# Altium schematic sheet Sheet1.SchDoc
size 420 x 297 mm; SheetNumber: 1; SheetTotal: 1
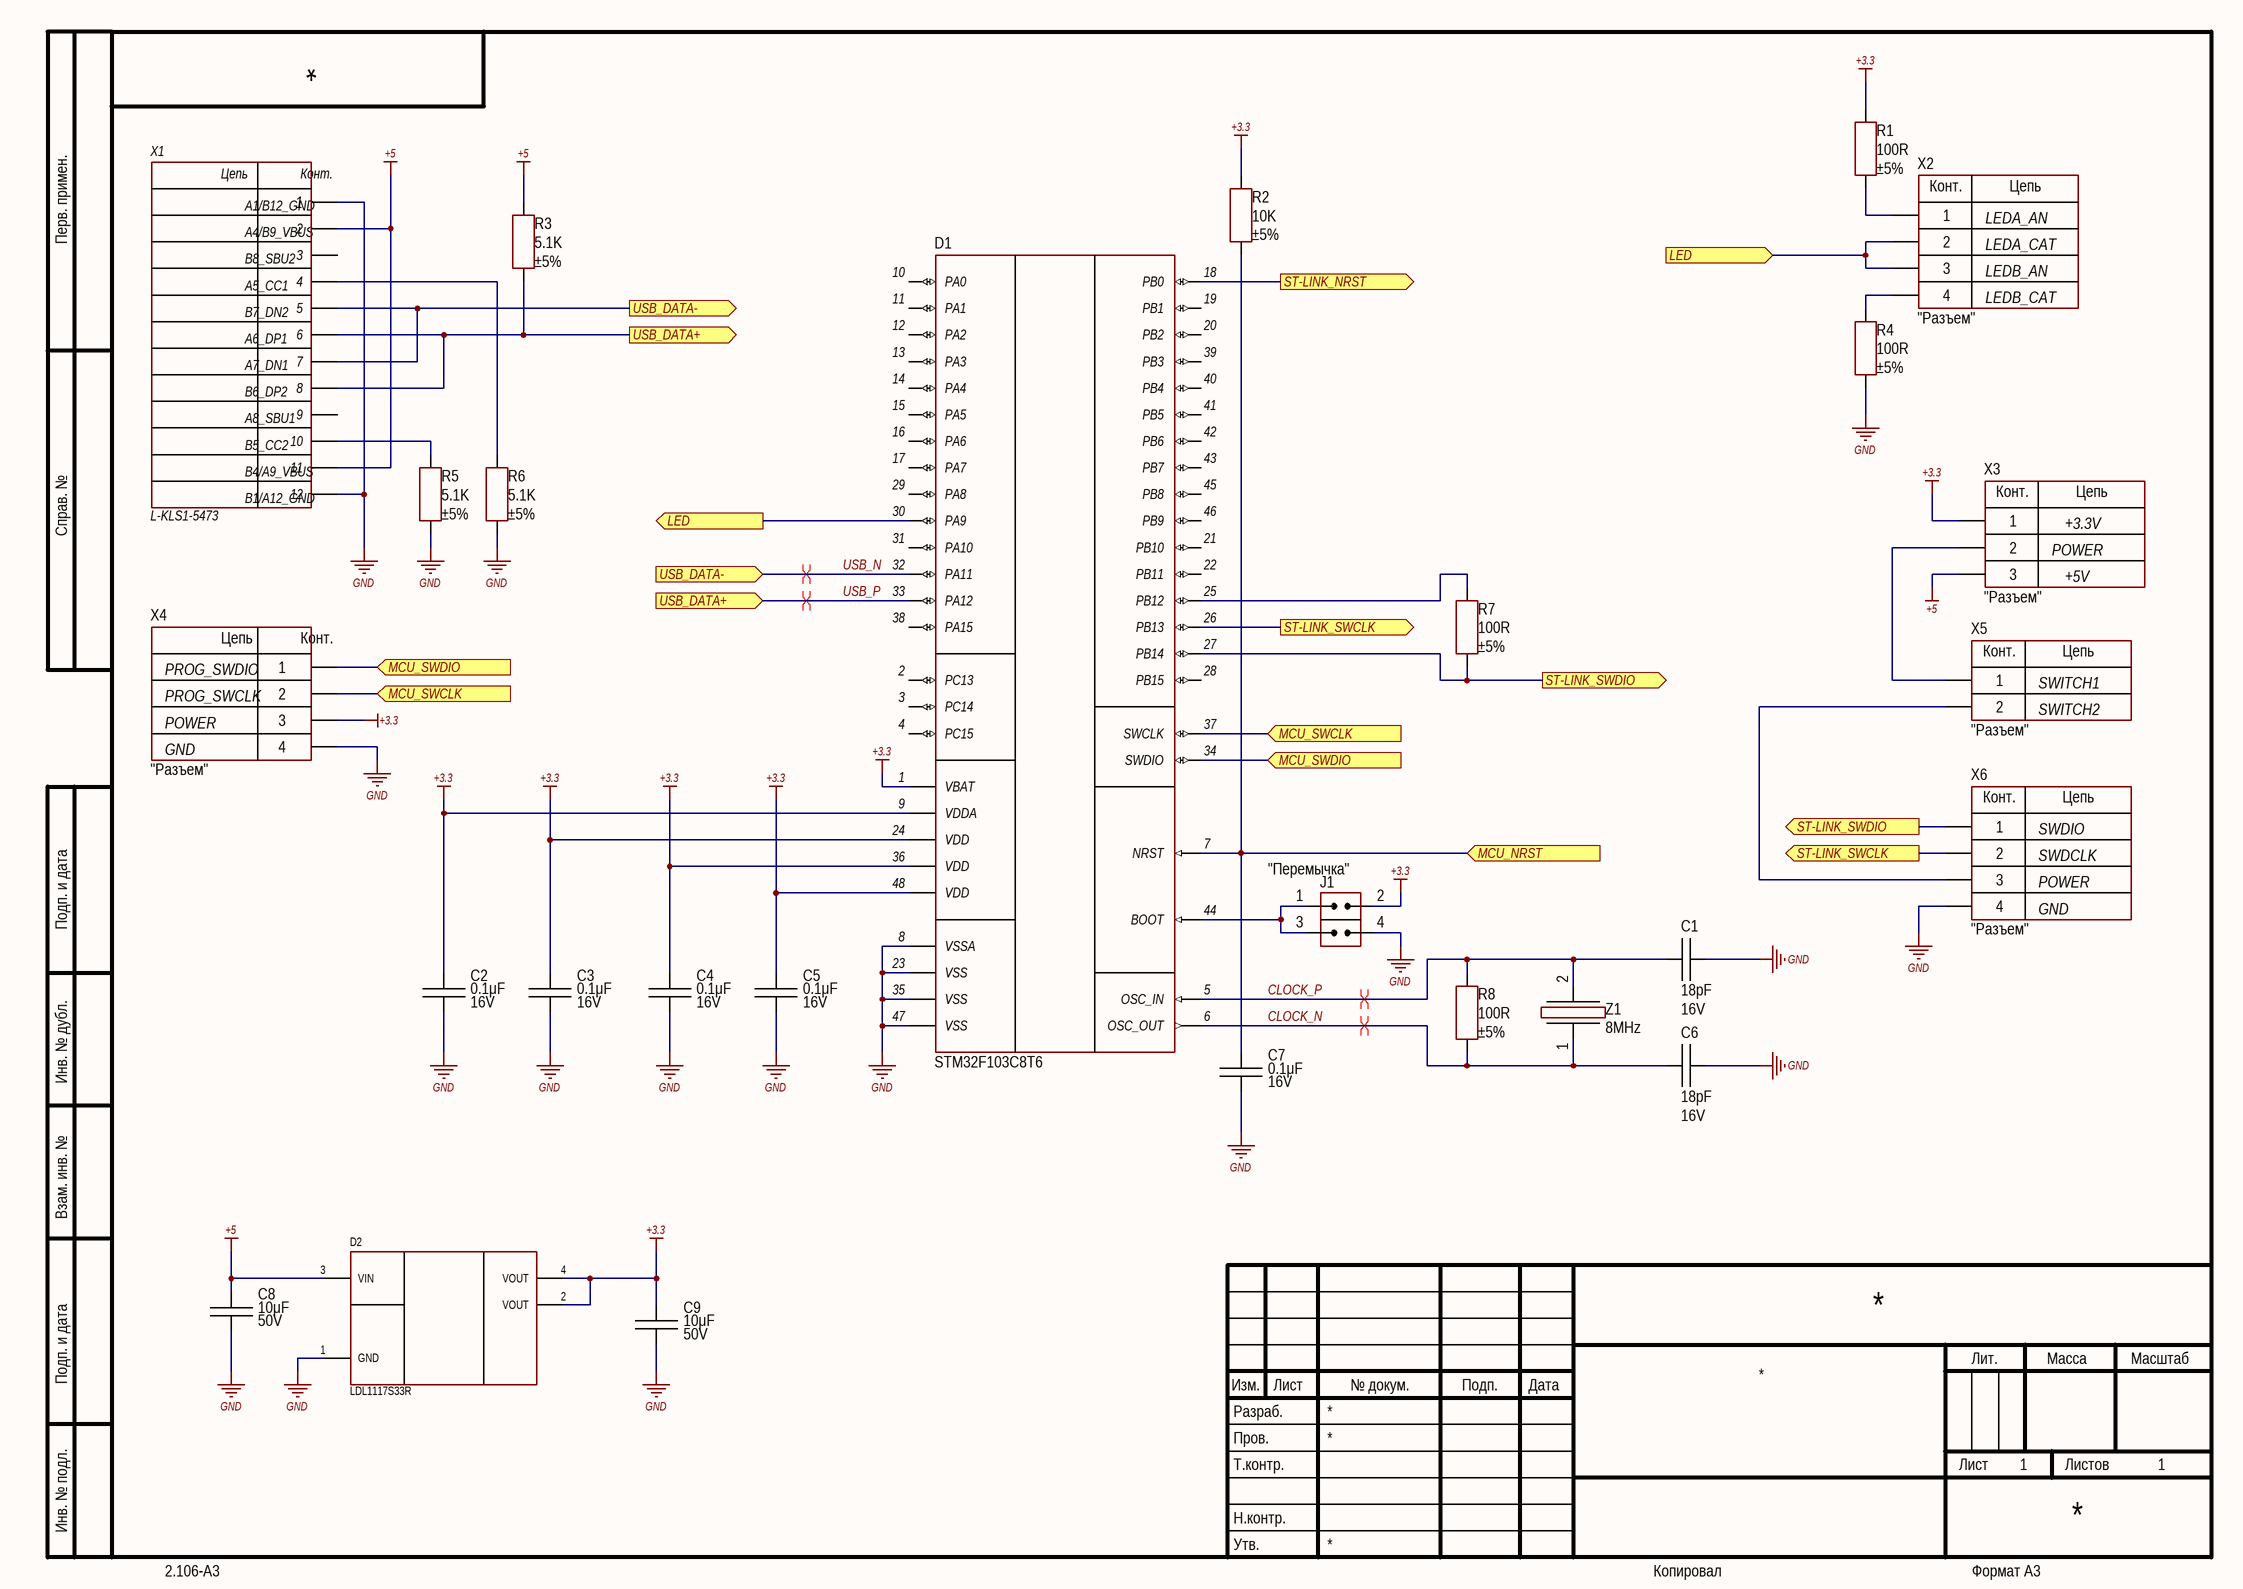
[diagram p0: Sheet1.SchDoc]

## Parts
C1  value 18pF  Voltage: 16V  [CAP: 0603]
C2  value 0.1μF  Voltage: 16V  [CAP: 0603]
C3  value 0.1μF  Voltage: 16V  [CAP: 0603]
C4  value 0.1μF  Voltage: 16V  [CAP: 0603]
C5  value 0.1μF  Voltage: 16V  [CAP: 0603]
C6  value 18pF  Voltage: 16V  [CAP: 0603]
C7  value 0.1μF  Voltage: 16V  [CAP: 0603]
C8  value 10μF  Voltage: 50V  [CAP: 1206]
C9  value 10μF  Voltage: 50V  [CAP: 1206]
D1  (no value)  [48-LQFP]
D2  (no value)  [SOT223]
J1  CommentText: "Перемычка"  [CON: JUMPER x2]
R1  value 100R  Tolerance: ±5%  [RES: 0603]
R2  value 10K  Tolerance: ±5%  [RES: 0603]
R3  value 5.1K  Tolerance: ±5%  [RES: 0603]
R4  value 100R  Tolerance: ±5%  [RES: 0603]
R5  value 5.1K  Tolerance: ±5%  [RES: 0603]
R6  value 5.1K  Tolerance: ±5%  [RES: 0603]
R7  value 100R  Tolerance: ±5%  [RES: 0603]
R8  value 100R  Tolerance: ±5%  [RES: 0603]
X1  (no value)  [USB type-C]
X2  CommentText: "Разъем"  [CON: PBS-4]
X3  CommentText: "Разъем"  [CON: PLS-3]
X4  CommentText: "Разъем"  [CON: PLS-4]
X5  CommentText: "Разъем"  [CON: PLS-2]
X6  CommentText: "Разъем"  [CON: PBS-4]
Z1  Frequency: 8MHz  [OSC: HC-49S]

## Ports
LED (in, see Sheet1[2B]), LED (out, see Sheet1[3A]), MCU_NRST (in), MCU_SWCLK (in, see Sheet1[1B]), MCU_SWCLK (in, see Sheet1[3B]), MCU_SWDIO (in, see Sheet1[1B]), MCU_SWDIO (in, see Sheet1[3B]), ST-LINK_NRST (out), ST-LINK_SWCLK (out, see Sheet1[3B]), ST-LINK_SWCLK (out, see Sheet1[4C]), ST-LINK_SWDIO (out, see Sheet1[3B]), ST-LINK_SWDIO (out, see Sheet1[4C]), USB_DATA+ (in, see Sheet1[2A]), USB_DATA+ (out, see Sheet1[2B]), USB_DATA- (in, see Sheet1[2A]), USB_DATA- (out, see Sheet1[2B])

## Nets
+3.3: C2.2 C3.2 C4.2 C5.2 C9.2 D1.1(VBAT) D1.9(VDDA) D1.24(VDD) D1.36(VDD) D1.48(VDD) D2.2(VOUT) D2.4(VOUT) J1.2(IN) R1.2 R2.2 X3.1 X4.3
+5: C8.2 D2.3(VIN) R3.2 X1.2 X1.11 X3.3
GND: C1.1 C2.1 C3.1 C4.1 C5.1 C6.1 C7.1 C8.1 C9.1 D1.8(VSSA) D1.23(VSS) D1.35(VSS) D1.47(VSS) D2.1(GND) J1.4(IN) R4.1 R5.1 R6.1 X1.1 X1.12 X4.4 X6.4
CLOCK_N: C6.2 D1.6(OSC_OUT) R8.1 Z1.1
CLOCK_P: C1.2 D1.5(OSC_IN) R8.2 Z1.2
LED: D1.30(PA9) X2.2 X2.3 ; port LED
MCU_NRST: C7.2 D1.7(NRST) R2.1 ; port MCU_NRST
MCU_SWCLK: D1.37(SWCLK) X4.2 ; port MCU_SWCLK
MCU_SWDIO: D1.34(SWDIO) X4.1 ; port MCU_SWDIO
ST-LINK_NRST: D1.18(PB0) ; port ST-LINK_NRST
ST-LINK_SWCLK: D1.26(PB13) X6.2 ; port ST-LINK_SWCLK
ST-LINK_SWDIO: D1.27(PB14) R7.1 X6.1 ; port ST-LINK_SWDIO
USB_N: D1.32(PA11) X1.5 X1.7 ; port USB_DATA-
USB_P: D1.33(PA12) R3.1 X1.6 X1.8 ; port USB_DATA+
NetD1_25: D1.25(PB12) R7.2
NetD1_44: D1.44(BOOT) J1.1(IN) J1.3(IN)
NetR1_1: R1.1 X2.1
NetR4_2: R4.2 X2.4
NetR5_2: R5.2 X1.10
NetR6_2: R6.2 X1.4
NetX3_2: X3.2 X5.1
NetX5_2: X5.2 X6.3

Not connected (* = marked no-connect by the designer): D1 2(PC13) 3(PC14) 4(PC15) 10(PA0) 11(PA1) 12(PA2) 13(PA3) 14(PA4) 15(PA5) 16(PA6) 17(PA7) 19(PB1) 20(PB2) 21(PB10) 22(PB11) 28(PB15) 29(PA8) 31(PA10) 38(PA15) 39(PB3) 40(PB4) 41(PB5) 42(PB6) 43(PB7) 45(PB8) 46(PB9); X1 3 9

## Layout directives
differential pair: CLOCK_N, CLOCK_P, USB_N, USB_P

## Notes on the sheet
- LEDA_AN
- LEDA_CAT
- LEDB_AN
- LEDB_CAT
- +3.3V
- POWER
- +5V
- PROG_SWDIO
- PROG_SWCLK
- SWITCH1
- SWITCH2
- GND
- SWDIO
- SWDCLK
- Перв. примен.
- Справ. №
- Подп. и дата
- Инв. № дубл.
- Взам. инв. №
- Разраб.
- Изм.
- Лист
- № докум.
- Подп.
- Дата
- Лит.
- Масса
- Масштаб
- Пров.
- Т.контр.
- Листов
- Инв. № подл.
- Утв.
- Н.контр.
- 2.106-A3
- Копировал
- Формат А3
- (in symbol L-KLS1-5473) Цепь; Конт.; A1/B12_GND; A4/B9_VBUS; B8_SBU2; A5_CC1; B7_DN2; A6_DP1; A7_DN1; B6_DP2; A8_SBU1; B5_CC2; B4/A9_VBUS; B1/A12_GND
- (in symbol PBS-4) Конт.; Цепь
- (in symbol PLS-2) Конт.; Цепь
- (in symbol PLS-3) Конт.; Цепь
- (in symbol PLS-4) Цепь; Конт.

## Library data of the parts
C1 C6 = Ceramic_0603: Manufacturer: Yageo; PartNumber: CC0603KRX7R7BB104; ValueManufacturerPartNumber: Ceramic capacitor, 18pF, X7R, ±10%, 16V, 0603, -55...+125°C; TypeCapacitor: Ceramic capacitor; Tolerance: ±10%; TypeDielectric: X7R; Package: 0603; HelpURL: https://www.digikey.com/product-detail/en/yageo/CC0603KRX7R7BB104/311-1088-1-ND/302998; Temperature: -55...+125°C
C2-C5 C7 = Ceramic_0603: Manufacturer: Yageo; PartNumber: CC0603KRX7R7BB104; ValueManufacturerPartNumber: Ceramic capacitor, 0.1μF, X7R, ±10%, 16V, 0603, -55...+125°C; TypeCapacitor: Ceramic capacitor; Tolerance: ±10%; TypeDielectric: X7R; Package: 0603; HelpURL: https://www.digikey.com/product-detail/en/yageo/CC0603KRX7R7BB104/311-1088-1-ND/302998; Temperature: -55...+125°C
C8 C9 = Ceramic_1206: Manufacturer: Yageo; PartNumber: CC1206KRX7R9BB104; ValueManufacturerPartNumber: Ceramic capacitor, 10μF, X7R, ±10%, 50V, 1206, -55...+125°C; TypeCapacitor: Ceramic capacitor; Tolerance: ±10%; TypeDielectric: X7R; Package: 1206; HelpURL: https://www.digikey.com/product-detail/en/yageo/CC1206KRX7R9BB104/311-1179-1-ND/303089; Temperature: -55...+125°C
D1 = STM32F103C8T6: Cortex-M3; Manufacturer: STMicroelectronics; ValueManufacturerPartNumber: IC microcontroller, 32-Bit, Cortex-M3, 72MHz, 64KB, 20KB, 2...3.6V, -40...+85°C, 48-LQFP; Supply: 2...3.6V; Speed: 72MHz; CoreSize: 32-Bit; MemoryROM: 64KB; MemoryRAM: 20KB; HelpURL: https://www.digikey.com/product-detail/en/stmicroelectronics/STM32F103C8T6TR/497-17666-1-ND/7804402; Package: 48-LQFP; ComponentType: IC microcontroller; Temperature: -40...+85°C; CoreProcessor: Cortex-M3; PartNumber: STM32F103C8T6
D2 = LDL1117S33R: Linear voltage regulator; Manufacturer: STMicroelectronics; ValueManufacturerPartNumber: Linear voltage regulator, input 3.9...18V, 0.6V, output 3.3V, 1.2A, -40...+85°C, SOT223; VoltageInput: input 3.9...18V; MaxDropout: 0.6V; CurrentOutput: 1.2A; VoltageOutput: output 3.3V; HelpURL: https://www.digikey.com/product-detail/en/stmicroelectronics/LDL1117S33R/497-17239-1-ND/7102079; Package: SOT223; ComponentType: Linear voltage regulator; Temperature: -40...+85°C; PartNumber: LDL1117S33R
J1 = Jumper_double
R1 R4 R7 R8 = Resistor_0603: Manufacturer: Yageo; PartNumber: RC0603JR-07100RL; ValueManufacturerPartNumber: Resistor film, 100R, ±5%, 0603, 0.1W, -55...+125°C; TypeResistor: Resistor film; Power: 0.1W; Package: 0603; HelpURL: https://www.digikey.com/product-detail/en/yageo/RC0603JR-07100RL/311-100GRCT-ND/729644; Temperature: -55...+125°C
R2 = Resistor_0603: Manufacturer: Yageo; PartNumber: RC0603JR-07100RL; ValueManufacturerPartNumber: Resistor film, 10K, ±5%, 0603, 0.1W, -55...+125°C; TypeResistor: Resistor film; Power: 0.1W; Package: 0603; HelpURL: https://www.digikey.com/product-detail/en/yageo/RC0603JR-07100RL/311-100GRCT-ND/729644; Temperature: -55...+125°C
R3 R5 R6 = Resistor_0603: Manufacturer: Yageo; PartNumber: RC0603JR-07100RL; ValueManufacturerPartNumber: Resistor film, 5.1K, ±5%, 0603, 0.1W, -55...+125°C; TypeResistor: Resistor film; Power: 0.1W; Package: 0603; HelpURL: https://www.digikey.com/product-detail/en/yageo/RC0603JR-07100RL/311-100GRCT-ND/729644; Temperature: -55...+125°C
X1 = L-KLS1-5473: Разъем L-KLS1-5473 / гнездо USB C 3.1 на плату (C8); Manufacturer: KLS; HelpURL: https://belchip.by/product/?selected_product=15991; ValueManufacturerPartNumber: =TypeConnector; PartNumber: L-KLS1-5473; CommentText: L-KLS1-5473
X2 X6 = PBS-4: Manufacturer: Connfly; ValueManufacturerPartNumber: Connector, 4pin, 2.54mm, 500VAC, 3A; TypeConnector: Connector; VoltageMax: 500VAC; Pitch: 2.54mm; CurrentMax: 3A; Multichannel: 4pin; HelpURL: https://www.chipdip.ru/product/pbs-4; PartNumber: PBS-4
X3 = PLS-3: Manufacturer: Connfly; ValueManufacturerPartNumber: Connector, 3pin, 2.54mm, 500VAC, 3A; TypeConnector: Connector; VoltageMax: 500VAC; Pitch: 2.54mm; CurrentMax: 3A; Multichannel: 3pin; HelpURL: https://www.chipdip.ru/product/pls-3; PartNumber: PLS-3
X4 = PLS-4: Manufacturer: Connfly; ValueManufacturerPartNumber: Connector, 4pin, 2.54mm, 500VAC, 3A; TypeConnector: Connector; VoltageMax: 500VAC; Pitch: 2.54mm; CurrentMax: 3A; Multichannel: 4pin; HelpURL: https://www.chipdip.ru/product/pls-4; PartNumber: PLS-4
X5 = PLS-2: Manufacturer: Connfly; ValueManufacturerPartNumber: Connector, 2pin, 2.54mm, 500VAC, 3A; TypeConnector: Connector; VoltageMax: 500VAC; Pitch: 2.54mm; CurrentMax: 3A; Multichannel: 2pin; HelpURL: https://www.chipdip.ru/product/pls-2; PartNumber: PLS-2
Z1 = Crystal_HC-49: Manufacturer: Epson; PartNumber: FC-135 32.7680KA-A5; ValueManufacturerPartNumber: Crystal, 8MHz, 12.5pF, ±20ppm, case 3215, -40...+85°C; LoadCapacitance: 12.5pF; Tolerance: ±20ppm; Package: case 3215; HelpURL: https://www.digikey.com/product-detail/en/epson/FC-135-32.7680KA-A5/SER4103CT-ND/6188447; Temperature: -40...+85°C; TypeOscilator: Crystal